# Altium schematic sheet RESISTORS.SchDoc: Current Divider
size A4; SheetNumber: 4; SheetTotal: 4
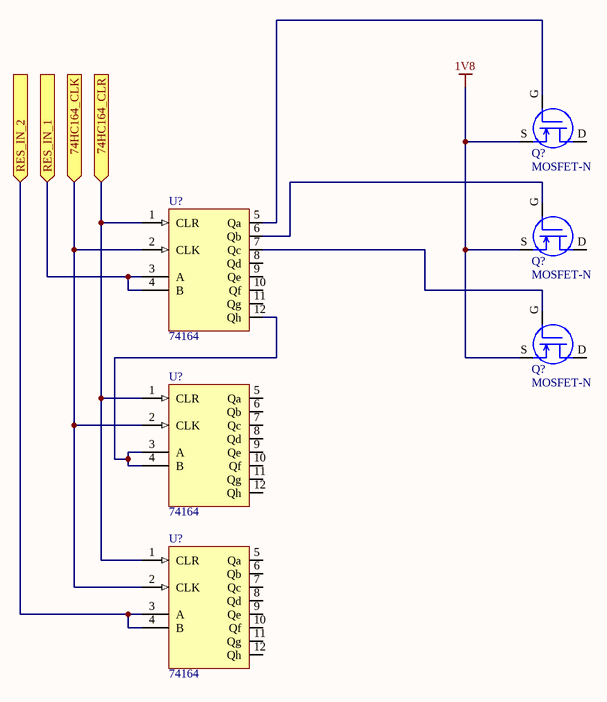
[diagram p0: RESISTORS.SchDoc]

## Parts
(Parts that share a designator on the sheet are numbered #1, #2 ... from top to bottom, then left to right.)
Q?#1  MOSFET-N
Q?#2  MOSFET-N
Q?#3  MOSFET-N
U?#1  74164
U?#2  74164
U?#3  74164

## Ports
74HC164_CLK (in), 74HC164_CLR (in), RES_IN_1 (in), RES_IN_2 (in)

## Nets
1V8: Q?#1.S Q?#2.S Q?#3.S
74HC164_CLK: U?#1.2(CLK) U?#2.2(CLK) U?#3.2(CLK) ; port 74HC164_CLK
74HC164_CLR: U?#1.1(CLR) U?#2.1(CLR) U?#3.1(CLR) ; port 74HC164_CLR
RES_IN_1: U?#1.3(A) U?#1.4(B) ; port RES_IN_1
RES_IN_2: U?#3.3(A) U?#3.4(B) ; port RES_IN_2
NetQ?#1_G: Q?#1.G U?#1.5(Qa)
NetQ?#2_G: Q?#2.G U?#1.6(Qb)
NetQ?#3_G: Q?#3.G U?#1.7(Qc)
NetU?#1_12: U?#1.12(Qh) U?#2.3(A) U?#2.4(B)

Not connected (* = marked no-connect by the designer): Q?#1 D; Q?#2 D; Q?#3 D; U?#1 8(Qd) 9(Qe) 10(Qf) 11(Qg); U?#2 5(Qa) 6(Qb) 7(Qc) 8(Qd) 9(Qe) 10(Qf) 11(Qg) 12(Qh); U?#3 5(Qa) 6(Qb) 7(Qc) 8(Qd) 9(Qe) 10(Qf) 11(Qg) 12(Qh)

## Library data of the parts
Q?#1-Q?#3 = N-Channel MOSFET: Misc. N-Channel MOSFET schematic symbol.
U?#1-U?#3 = 74HC164: 8-Bit Shift Register